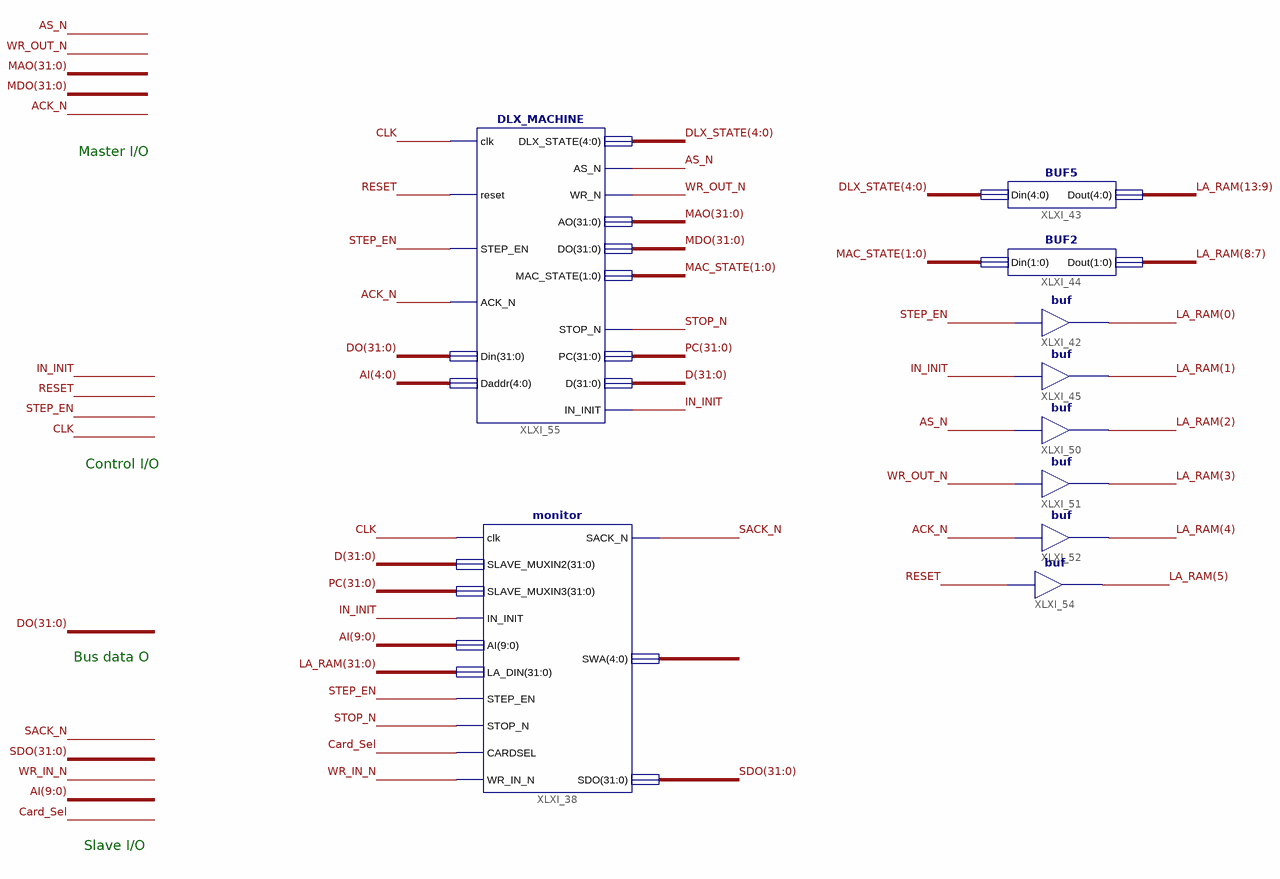
[diagram p0: schematic sheet 1]
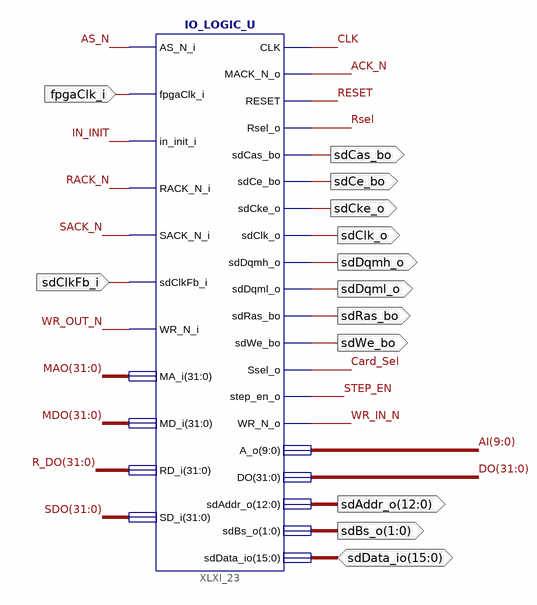
[diagram p1: schematic sheet 2]
// Xilinx ISE schematic Top_Level.sch (spartan6) as structural Verilog: 11 symbols, 13 ports
module Top_Level (
  input  fpgaClk_i,
  input  sdClkFb_i,
  inout  [15:0] sdData_io,
  output sdClk_o,
  output [1:0] sdBs_o,
  output sdDqml_o,
  output sdDqmh_o,
  output sdWe_bo,
  output sdCas_bo,
  output sdRas_bo,
  output sdCe_bo,
  output sdCke_o,
  output [12:0] sdAddr_o
);

  wire ACK_N, AS_N, Card_Sel, CLK, IN_INIT, RACK_N, RESET, Rsel, SACK_N, STEP_EN, STOP_N, WR_IN_N, WR_OUT_N;
  wire [1:0] MAC_STATE;
  wire [4:0] DLX_STATE, XLXN_35;
  wire [9:0] AI;
  wire [31:0] D, DO, LA_RAM, MAO, MDO, PC, R_DO, SDO;

  IO_LOGIC_U XLXI_23 (
    .AS_N_i(AS_N), .fpgaClk_i(fpgaClk_i), .in_init_i(IN_INIT), .RACK_N_i(RACK_N), .SACK_N_i(SACK_N),
    .sdClkFb_i(sdClkFb_i), .WR_N_i(WR_OUT_N), .MA_i(MAO), .MD_i(MDO), .RD_i(R_DO), .SD_i(SDO), .CLK(CLK),
    .MACK_N_o(ACK_N), .RESET(RESET), .Rsel_o(Rsel), .sdCas_bo(sdCas_bo), .sdCe_bo(sdCe_bo),
    .sdCke_o(sdCke_o), .sdClk_o(sdClk_o), .sdDqmh_o(sdDqmh_o), .sdDqml_o(sdDqml_o), .sdRas_bo(sdRas_bo),
    .sdWe_bo(sdWe_bo), .Ssel_o(Card_Sel), .step_en_o(STEP_EN), .WR_N_o(WR_IN_N), .A_o(AI), .DO(DO),
    .sdAddr_o(sdAddr_o), .sdBs_o(sdBs_o), .sdData_io(sdData_io));
  monitor XLXI_38 (
    .clk(CLK), .SLAVE_MUXIN2(D), .SLAVE_MUXIN3(PC), .IN_INIT(IN_INIT), .AI(AI), .LA_DIN(LA_RAM),
    .STEP_EN(STEP_EN), .STOP_N(STOP_N), .CARDSEL(Card_Sel), .WR_IN_N(WR_IN_N), .SACK_N(SACK_N),
    .SWA(XLXN_35), .SDO(SDO));
  buf XLXI_42 (LA_RAM[0], STEP_EN);
  BUF5 XLXI_43 (.Din(DLX_STATE), .Dout(LA_RAM[13:9]));
  BUF2 XLXI_44 (.Din(MAC_STATE), .Dout(LA_RAM[8:7]));
  buf XLXI_45 (LA_RAM[1], IN_INIT);
  buf XLXI_50 (LA_RAM[2], AS_N);
  buf XLXI_51 (LA_RAM[3], WR_OUT_N);
  buf XLXI_52 (LA_RAM[4], ACK_N);
  DLX_MACHINE XLXI_55 (
    .clk(CLK), .reset(RESET), .STEP_EN(STEP_EN), .ACK_N(ACK_N), .Din(DO), .Daddr(AI[4:0]),
    .DLX_STATE(DLX_STATE), .AS_N(AS_N), .WR_N(WR_OUT_N), .AO(MAO), .DO(MDO), .MAC_STATE(MAC_STATE),
    .STOP_N(STOP_N), .PC(PC), .D(D), .IN_INIT(IN_INIT));
  buf XLXI_54 (LA_RAM[5], RESET);

  // Notes on the sheet:
  //   Master I/O
  //   Control I/O
  //   Bus data O
  //   Slave I/O
endmodule
